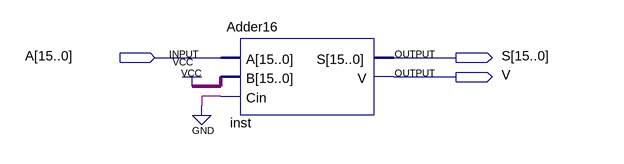
[diagram p0: schematic sheet]
// Quartus schematic Sub16a1.bdf as structural Verilog: 1 symbols, 3 pins
module Sub16a1 (
  input  [15:0] A,
  output [15:0] S,
  output V
);

  Adder16 inst (.A(A), .B({16{1'b1}}), .Cin(1'b0), .S(S), .V(V));
endmodule
